# Altium schematic sheet CPU.SchDoc
size A3
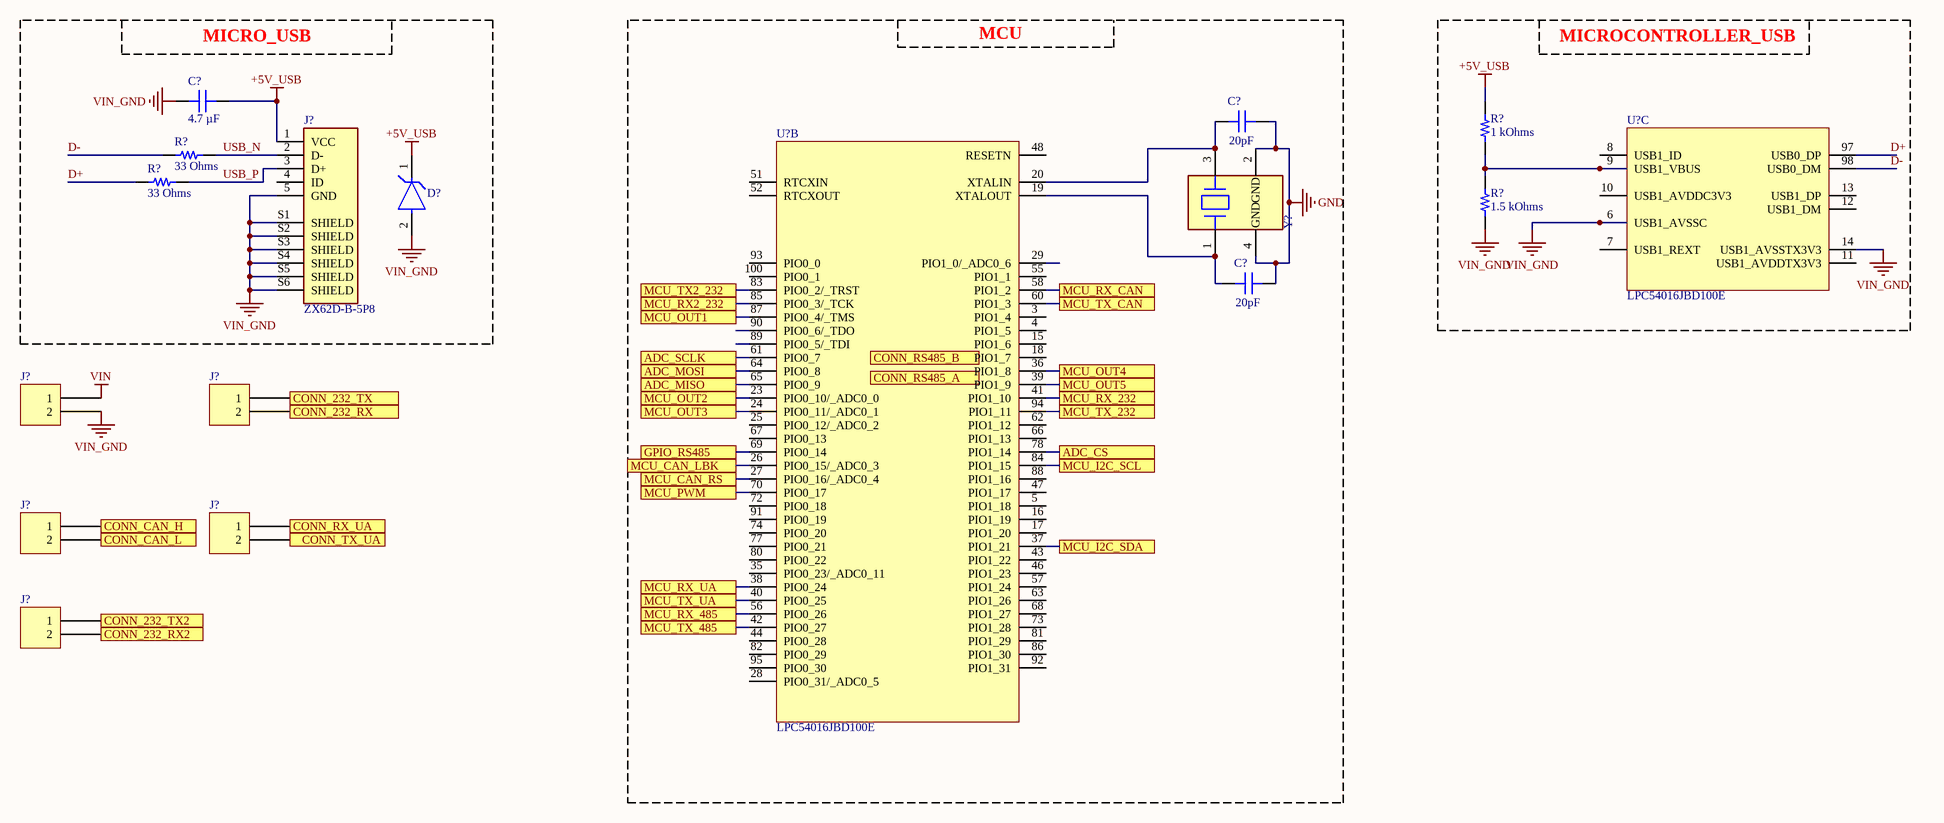
[diagram p0: CPU.SchDoc]

## Parts
(Parts that share a designator on the sheet are numbered #1, #2 ... from top to bottom, then left to right.)
C?#1  4.7 µF  [CAP 0603_1608]
C?#2  20pF  [CAP 0603_1608]
C?#3  20pF  [CAP 0603_1608]
D?  ESDA7P60-1U1M  [TVS-1610]  (value not drawn)
J?#1  ZX62D-B-5P8  [HRS_ZX62D-B-5P8]
J?#2  282834-2  [TE 282834-2]  (value not drawn)
J?#3  282834-2  [TE 282834-2]  (value not drawn)
J?#4  282834-2  [TE 282834-2]  (value not drawn)
J?#5  282834-2  [TE 282834-2]  (value not drawn)
J?#6  282834-2  [TE 282834-2]  (value not drawn)
R?#1  1 kOhms  [RES 0603_1608]
R?#2  33 Ohms  [RES 0603_1608]
R?#3  33 Ohms  [RES 0603_1608]
R?#4  1.5 kOhms  [RES 0603_1608]
U?#1  LPC54016JBD100E  [LQFP-100]  (part C of 3)
U?#2  LPC54016JBD100E  [LQFP-100]  (part B of 3)
Y?  8Z-12.000MAAJ-T  [TXC_8Z_MFG]  (value not drawn)

## Blocks framed on the sheet
MICRO_USB: C?#1 D? J?#1 R?#2 R?#3
MCU: C?#2 C?#3 U?#2 Y?
MICROCONTROLLER_USB: R?#1 R?#4 U?#1

## Ports
ADC_CS, ADC_MISO, ADC_MOSI, ADC_SCLK, CONN_232_RX, CONN_232_RX2, CONN_232_TX, CONN_232_TX2, CONN_CAN_H, CONN_CAN_L, CONN_RS485_A, CONN_RS485_B, CONN_RX_UA, CONN_TX_UA, GPIO_RS485, MCU_CAN_LBK, MCU_CAN_RS, MCU_I2C_SCL, MCU_I2C_SDA, MCU_OUT1, MCU_OUT2, MCU_OUT3, MCU_OUT4, MCU_OUT5, MCU_PWM, MCU_RX2_232, MCU_RX_232, MCU_RX_485, MCU_RX_CAN, MCU_RX_UA, MCU_TX2_232, MCU_TX_232, MCU_TX_485, MCU_TX_CAN, MCU_TX_UA

## Nets
+5V_USB: C?#1.2 D?.1(C) J?#1.1(VCC) R?#1.2
GND: C?#2.2 C?#3.2 Y?.2(GND) Y?.4(GND)
VIN: J?#2.1
VIN_GND: C?#1.1 D?.2(A) J?#1.5(GND) J?#1.S1(SHIELD) J?#1.S2(SHIELD) J?#1.S3(SHIELD) J?#1.S4(SHIELD) J?#1.S5(SHIELD) J?#1.S6(SHIELD) J?#2.2 R?#4.1 U?#1.6(USB1_AVSSC) U?#1.14(USB1_AVSSTX3V3)
ADC_CS: U?#2.78(PIO1_14) ; port ADC_CS
ADC_MISO: U?#2.65(PIO0_9) ; port ADC_MISO
ADC_MOSI: U?#2.64(PIO0_8) ; port ADC_MOSI
ADC_SCLK: U?#2.61(PIO0_7) ; port ADC_SCLK
CONN_232_RX: J?#3.2 ; port CONN_232_RX
CONN_232_RX2: J?#6.2 ; port CONN_232_RX2
CONN_232_TX: J?#3.1 ; port CONN_232_TX
CONN_232_TX2: J?#6.1 ; port CONN_232_TX2
CONN_CAN_H: J?#4.1 ; port CONN_CAN_H
CONN_CAN_L: J?#4.2 ; port CONN_CAN_L
CONN_RX_UA: J?#5.1 ; port CONN_RX_UA
CONN_TX_UA: J?#5.2 ; port CONN_TX_UA
D+: R?#3.1 U?#1.97(USB0_DP)
D-: R?#2.1 U?#1.98(USB0_DM)
GPIO_RS485: U?#2.69(PIO0_14) ; port GPIO_RS485
MCU_CAN_LBK: U?#2.26(PIO0_15/_ADC0_3) ; port MCU_CAN_LBK
MCU_CAN_RS: U?#2.27(PIO0_16/_ADC0_4) ; port MCU_CAN_RS
MCU_I2C_SCL: U?#2.84(PIO1_15) ; port MCU_I2C_SCL
MCU_I2C_SDA: U?#2.37(PIO1_21) ; port MCU_I2C_SDA
MCU_OUT1: U?#2.87(PIO0_4/_TMS) ; port MCU_OUT1
MCU_OUT2: U?#2.23(PIO0_10/_ADC0_0) ; port MCU_OUT2
MCU_OUT3: U?#2.24(PIO0_11/_ADC0_1) ; port MCU_OUT3
MCU_OUT4: U?#2.36(PIO1_8) ; port MCU_OUT4
MCU_OUT5: U?#2.39(PIO1_9) ; port MCU_OUT5
MCU_PWM: U?#2.70(PIO0_17) ; port MCU_PWM
MCU_RX2_232: U?#2.85(PIO0_3/_TCK) ; port MCU_RX2_232
MCU_RX_232: U?#2.41(PIO1_10) ; port MCU_RX_232
MCU_RX_485: U?#2.56(PIO0_26) ; port MCU_RX_485
MCU_RX_CAN: U?#2.58(PIO1_2) ; port MCU_RX_CAN
MCU_RX_UA: U?#2.38(PIO0_24) ; port MCU_RX_UA
MCU_TX2_232: U?#2.83(PIO0_2/_TRST) ; port MCU_TX2_232
MCU_TX_232: U?#2.94(PIO1_11) ; port MCU_TX_232
MCU_TX_485: U?#2.42(PIO0_27) ; port MCU_TX_485
MCU_TX_CAN: U?#2.60(PIO1_3) ; port MCU_TX_CAN
MCU_TX_UA: U?#2.40(PIO0_25) ; port MCU_TX_UA
USB_N: J?#1.2(D-) R?#2.2
USB_P: J?#1.3(D+) R?#3.2
NetC?#2_1: C?#2.1 U?#2.20(XTALIN) Y?.3
NetC?#3_1: C?#3.1 U?#2.19(XTALOUT) Y?.1
NetR?#1_1: R?#1.1 R?#4.2 U?#1.9(USB1_VBUS)

Not connected (* = marked no-connect by the designer): J?#1 4(ID); U?#1 7(USB1_REXT) 8(USB1_ID) 10(USB1_AVDDC3V3) 11(USB1_AVDDTX3V3) 12(USB1_DM) 13(USB1_DP); U?#2 3(PIO1_4) 4(PIO1_5) 5(PIO1_18) 15(PIO1_6) 16(PIO1_19) 17(PIO1_20) 18(PIO1_7) 25(PIO0_12/_ADC0_2) 28(PIO0_31/_ADC0_5) 29(PIO1_0/_ADC0_6) 35(PIO0_23/_ADC0_11) 43(PIO1_22) 44(PIO0_28) 46(PIO1_23) 47(PIO1_17) 48(RESETN) 51(RTCXIN) 52(RTCXOUT) 55(PIO1_1) 57(PIO1_24) 62(PIO1_12) 63(PIO1_26) 66(PIO1_13) 67(PIO0_13) 68(PIO1_27) 72(PIO0_18) 73(PIO1_28) 74(PIO0_20) 77(PIO0_21) 80(PIO0_22) 81(PIO1_29) 82(PIO0_29) 86(PIO1_30) 88(PIO1_16) 89(PIO0_5/_TDI) 90(PIO0_6/_TDO) 91(PIO0_19) 92(PIO1_31) 93(PIO0_0) 95(PIO0_30) 100(PIO0_1)

## Library data of the parts
C?#1 = CL10A475KP8NNNC: CAP CER 4.7UF 10V X5R 0603; manufacturer: Samsung Electro-Mechanics; Tolerance: ±10%; Part Number: CL10A475KP8NNNC; Value: 4.7 µF; Applications: General Purpose; Capacitance: 4.7 µF; componentlink1description: Datasheet; componentlink1url: http://www.samsungsem.com/kr/support/product-search/mlcc/CL10A475KP8NNNC.jsp; componentlink2description: DigiKey Link; componentlink2url: https://www.digikey.com/en/products/detail/samsung-electro-mechanics/CL10A475KP8NNNC/3886702; Device Package: 0603 (1608 Metric); lastupdated: 12.04.2022 22:08:21; Lifecycle Status: Active; Minimum Order: 1; Mounting Type: Surface Mount, MLCC; Operating Temperature: -55°C ~ 85°C; Package / Case: 0603 (1608 Metric); packaging: TapeAndReel; partid: 5671; Part Status: Active; price: 0.01; series: CL; Size / Dimension: 0.063" L x 0.031" W (1.60mm x 0.80mm); Supplier 1: DigiKey; Supplier Part Number 1: 1276-1044-1-ND; Temperature Coefficient: X5R; Thickness (Max): 0.035" (0.90mm); Voltage - Rated: 10V
C?#2 C?#3 = 06035A200JAT2A: CAP CER 20PF 50V C0G/NP0 0603; manufacturer: AVX Corporation; Temperature Coefficient: C0G, NP0; Tolerance: ±5%; Part Number: 06035A200JAT2A; Value: 20pF; Applications: General Purpose; Capacitance: 20pF; componentlink1description: Datasheet; componentlink1url: http://datasheets.avx.com/C0GNP0-Dielectric.pdf; componentlink2description: DigiKey Link; componentlink2url: http://digikey.com/product-detail/en/avx-corporation/06035A200JAT2A/478-7912-1-ND/3881535; Device Package: 0603 (1608 Metric); lastupdated: 2.09.2020 01:03:27; Lifecycle Status: Active; Minimum Order: 1; Mounting Type: Surface Mount, MLCC; Operating Temperature: -55°C ~ 125°C; Package / Case: 0603 (1608 Metric); packaging: TapeAndReel; partid: 7153; Part Status: Active; price: 0.04; series: -; Size / Dimension: 0.063" L x 0.032" W (1.60mm x 0.81mm); Supplier 1: DigiKey; Supplier Part Number 1: 478-7912-1-ND; Thickness (Max): 0.035" (0.90mm); Voltage - Rated: 50V
D? = ESDA7P60-1U1M: ESDA Series 6.4 V 700 W SMT Uni-Directional TVS Diode - 1610; Manufacturer: STMicroelectronics; Number of Unidirectional Channels: 1; Reverse Standoff Voltage: 5V; Min Breakdown Voltage: 6.4V; Clamping Voltage: 11.6V; Peak Pulse Power: 700W; Power Line Protection: No; Polarity: Unidirectional; Max Breakdown Voltage: 7.2V; Peak Pulse Current: 60A; Supplier 1: Digi-Key; Manufacturer Part Number: ESDA7P60-1U1M; RoHS: Yes; Category: TVS Diodes; Stock 1: 12994; Pricing 1: 1=0,51000, 10=0,38400, 100=0,23910, 500=0,16360, 1000=0,12584, 2000=0,11326 (USD); Mount: Surface Mount; Case/Package: 1610; Number of Pins: 2; Min Operating Temperature: -55°C; Max Operating Temperature: 150°C; Packaging: Cut Tape; Resistor Type: Zener; REACH SVHC: No SVHC; RoHS Compliant: Yes; ComponentLink1URL: http://www.farnell.com/datasheets/2041290.pdf?src-supplier=Farnell; ComponentLink1Description: http://www.farnell.com/datasheets/2041290.pdf?src-supplier=Farnell; ComponentLink2URL: http://www.st.com/content/ccc/resource/technical/document/datasheet/44/e9/26/44/42/ee/4f/e5/DM00139972.pdf/files/DM00139972.pdf/jcr:content/translations/en.DM00139972.pdf?src-supplier=Digi-Key; ComponentLink2Description: http://www.st.com/content/ccc/resource/technical/document/datasheet/44/e9/26/44/42/ee/4f/e5/DM00139972.pdf/files/DM00139972.pdf/jcr:content/translations/en.DM00139972.pdf?src-supplier=Digi-Key; ComponentLink3URL: http://www.farnell.com/datasheets/2041290.pdf?src-supplier=Element14; ComponentLink3Description: http://www.farnell.com/datasheets/2041290.pdf?src-supplier=Element14; Supplier Part Number 1: 497-16253-1-ND
J?#1 = ZX62D-B-5P8: Conn Micro USB 2.0 Type B RCP 5 POS 0.65mm Solder RA SMD 5 Terminal 1 Port Embossed T/R; MF: Hirose; Value: *; Availability: Unavailable; SnapEDA_Link: https://www.snapeda.com/parts/ZX62D-B-5P8/Hirose%20Electric%20Co%20Ltd/view-part/46842/?ref=snap; Package: FakePackage u; MP: ZX62D-B-5P8; Price: None
J?#2-J?#6 = 282834-2: TERM BLK 2P SIDE ENT 2.54MM PCB; Manufacturer: TE Connectivity AMP Connectors; Current: 10A; Mating Orientation: Horizontal with Board; Number of Levels: 1; Pitch: 0.100" (2.54mm); Positions Per Level: 2; Voltage: 150V; Wire Gauge: 16-30 AWG; Wire Termination: Screw - Rising Cage Clamp; Part Number: 282834-2; Color: Green; ComponentLink1Description: Datasheet; ComponentLink1URL: https://www.te.com/commerce/DocumentDelivery/DDEController?Action=srchrtrv&DocNm=282834&DocType=Customer+Drawing&DocLang=English; ComponentLink2Description: DigiKey Link; ComponentLink2URL: http://digikey.com/product-detail/en/te-connectivity-amp-connectors/282834-2/A98333-ND/1150135; LastUpdated: 15.01.2020 04:15:38; Lifecycle Status: Active; Minimum Order: 1; Mounting Type: Through Hole; Packaging: Bulk; Part Status: Active; Price: 0.88; Series: Buchanan; Supplier 1: DigiKey; Supplier Part Number 1: A98333-ND
R?#1 = TNPU06031K00BZEA00: RES 1 KOHM 0.1% 1/10W 0603; Manufacturer: Vishay Dale; Power (Watts): 0.1W, 1/10W; Temperature Coefficient: ±5ppm/°C; Part Number: TNPU06031K00BZEA00; Value: 1 kOhms; ComponentLink1Description: Datasheet; ComponentLink1URL: http://www.vishay.com/docs/28779/tnpue3.pdf; ComponentLink2Description: DigiKey Link; ComponentLink2URL: https://www.digikey.com/en/products/detail/vishay-dale/TNPU06031K00BZEA00/9448843; Composition: Thin Film; Device Package: 0603 (1608 Metric); Features: Anti-Sulfur, Automotive AEC-Q200, Moisture Resistant; Height - Seated (Max): 0.022" (0.55mm); LastUpdated: 12.04.2022 22:27:30; Lifecycle Status: Active; Minimum Order: 1; Number of Terminations: 2; Operating Temperature: -55°C ~ 125°C; Package / Case: 0603 (1608 Metric); Packaging: TapeAndReel; PartId: 11509; Part Status: Active; Price: 0.77; Ratings: AEC-Q200; Resistance: 1 kOhms; Series: TNPU e3; Size / Dimension: 0.063" L x 0.033" W (1.60mm x 0.85mm); Supplier 1: DigiKey; Supplier Part Number 1: 541-4650-1-ND; Supplier Device Package: 0603; Tolerance: ±0.1%
R?#2 R?#3 = CRGP0603F33R: RES 33 OHM 1% 1/4W 0603; Manufacturer: TE Connectivity Passive Product; Power (Watts): 0.25W, 1/4W; Temperature Coefficient: ±200ppm/°C; Part Number: CRGP0603F33R; Value: 33 Ohms; ComponentLink1Description: Datasheet; ComponentLink1URL: https://www.te.com/commerce/DocumentDelivery/DDEController?Action=srchrtrv&DocNm=9-1773463-9&DocType=DS&DocLang=English; ComponentLink2Description: DigiKey Link; ComponentLink2URL: https://www.digikey.com/en/products/detail/te-connectivity-passive-product/CRGP0603F33R/8577000; Composition: Thick Film; Device Package: 0603 (1608 Metric); Features: Pulse Withstanding; Height - Seated (Max): 0.022" (0.55mm); LastUpdated: 12.04.2022 22:26:54; Lifecycle Status: Active; Minimum Order: 1; Number of Terminations: 2; Operating Temperature: -55°C ~ 155°C; Package / Case: 0603 (1608 Metric); Packaging: TapeAndReel; PartId: 20893; Part Status: Active; Price: 0.02; Resistance: 33 Ohms; Series: CRGP; Size / Dimension: 0.063" L x 0.031" W (1.60mm x 0.80mm); Supplier 1: DigiKey; Supplier Part Number 1: A130398CT-ND; Supplier Device Package: 0603; Tolerance: ±1%
R?#4 = CRGP0603F1K5: RES 1.5K OHM 1% 1/4W 0603; Manufacturer: TE Connectivity Passive Product; Power (Watts): 0.25W, 1/4W; Temperature Coefficient: ±100ppm/°C; Part Number: CRGP0603F1K5; Value: 1.5 kOhms; ComponentLink1Description: Datasheet; ComponentLink1URL: https://www.te.com/commerce/DocumentDelivery/DDEController?Action=srchrtrv&DocNm=9-1773463-9&DocType=DS&DocLang=English; ComponentLink2Description: DigiKey Link; ComponentLink2URL: https://www.digikey.com/en/products/detail/te-connectivity-passive-product/CRGP0603F1K5/8577020; Composition: Thick Film; Device Package: 0603 (1608 Metric); Features: Pulse Withstanding; Height - Seated (Max): 0.022" (0.55mm); LastUpdated: 12.04.2022 22:27:55; Lifecycle Status: Active; Minimum Order: 1; Number of Terminations: 2; Operating Temperature: -55°C ~ 155°C; Package / Case: 0603 (1608 Metric); Packaging: TapeAndReel; PartId: 5000; Part Status: Active; Price: 0.02; Resistance: 1.5 kOhms; Series: CRGP; Size / Dimension: 0.063" L x 0.031" W (1.60mm x 0.80mm); Supplier 1: DigiKey; Supplier Part Number 1: A130418CT-ND; Supplier Device Package: 0603; Tolerance: ±1%
U?#1 U?#2 = LPC54016JBD100E: MCU 32-Bit LPC54016 ARM Cortex-M4 RISC ROM Less 1.71V to 3.6V 100-Pin LQFP Tray; Manufacturer: NXP Semiconductors; Supplier 1: Digi-Key; Manufacturer Part Number: LPC54016JBD100E; RoHS: No; Category: Microcontrollers; Stock 1: 1; Pricing 1: 1=11,88000 (USD); Supplier Part Number 1: 568-13835-ND
Y? = 8Z-12.000MAAJ-T: CRYSTAL 12.0000MHZ 18PF SMD; Manufacturer: TXC; Frequency: 12MHz; Frequency Tolerance: 30ppm; ESR (Equivalent Series Resistance): 150R; Supplier 1: Digi-Key; Manufacturer Part Number: 8Z-12.000MAAJ-T; RoHS: Yes; Category: Crystals; Stock 1: 83431; Pricing 1: 1=1,18000, 10=1,04500, 50=0,97720, 100=0,86360, 500=0,81810, 1000=0,68175 (USD); Mount: Surface Mount; Case/Package: SMD/SMT; Number of Pins: 4; Min Operating Temperature: -20°C; Max Operating Temperature: 70°C; Package Quantity: 1; Load Capacitance: 18pF; Packaging: Tape and Reel; Tolerance: 30ppm; Frequency Stability: 30ppm; Termination: SMD/SMT; Series: 8Z; Length: 2.5mm; Width: 0.079inch; Height: 0.022inch; Depth: 2mm; REACH SVHC: No SVHC; RoHS Compliant: Yes; ComponentLink1URL: https://datasheet.ciiva.com/28498/1838674-28498900.pdf?src-supplier=Element14; ComponentLink1Description: https://datasheet.ciiva.com/28498/1838674-28498900.pdf?src-supplier=Element14; ComponentLink2URL: https://datasheet.ciiva.com/4950/8z-12784-4950167.pdf?src-supplier=Mouser; ComponentLink2Description: https://datasheet.ciiva.com/4950/8z-12784-4950167.pdf?src-supplier=Mouser; ComponentLink3URL: https://datasheet.ciiva.com/8047/1041872-8047871.pdf?src-supplier=Element14; ComponentLink3Description: https://datasheet.ciiva.com/8047/1041872-8047871.pdf?src-supplier=Element14; ComponentLink4URL: https://datasheet.ciiva.com/859/8z-859072.pdf?src-supplier=Digi-Key; ComponentLink4Description: https://datasheet.ciiva.com/859/8z-859072.pdf?src-supplier=Digi-Key; ComponentLink5URL: https://datasheet.ciiva.com/859/8z-859071.pdf?src-supplier=Digi-Key; ComponentLink5Description: https://datasheet.ciiva.com/859/8z-859071.pdf?src-supplier=Digi-Key; ComponentLink6URL: https://datasheet.ciiva.com/859/8z-859073.pdf?src-supplier=Digi-Key; ComponentLink6Description: https://datasheet.ciiva.com/859/8z-859073.pdf?src-supplier=Digi-Key; Supplier Part Number 1: 887-1487-1-ND